# Altium project Function_Generator.PrjPcb
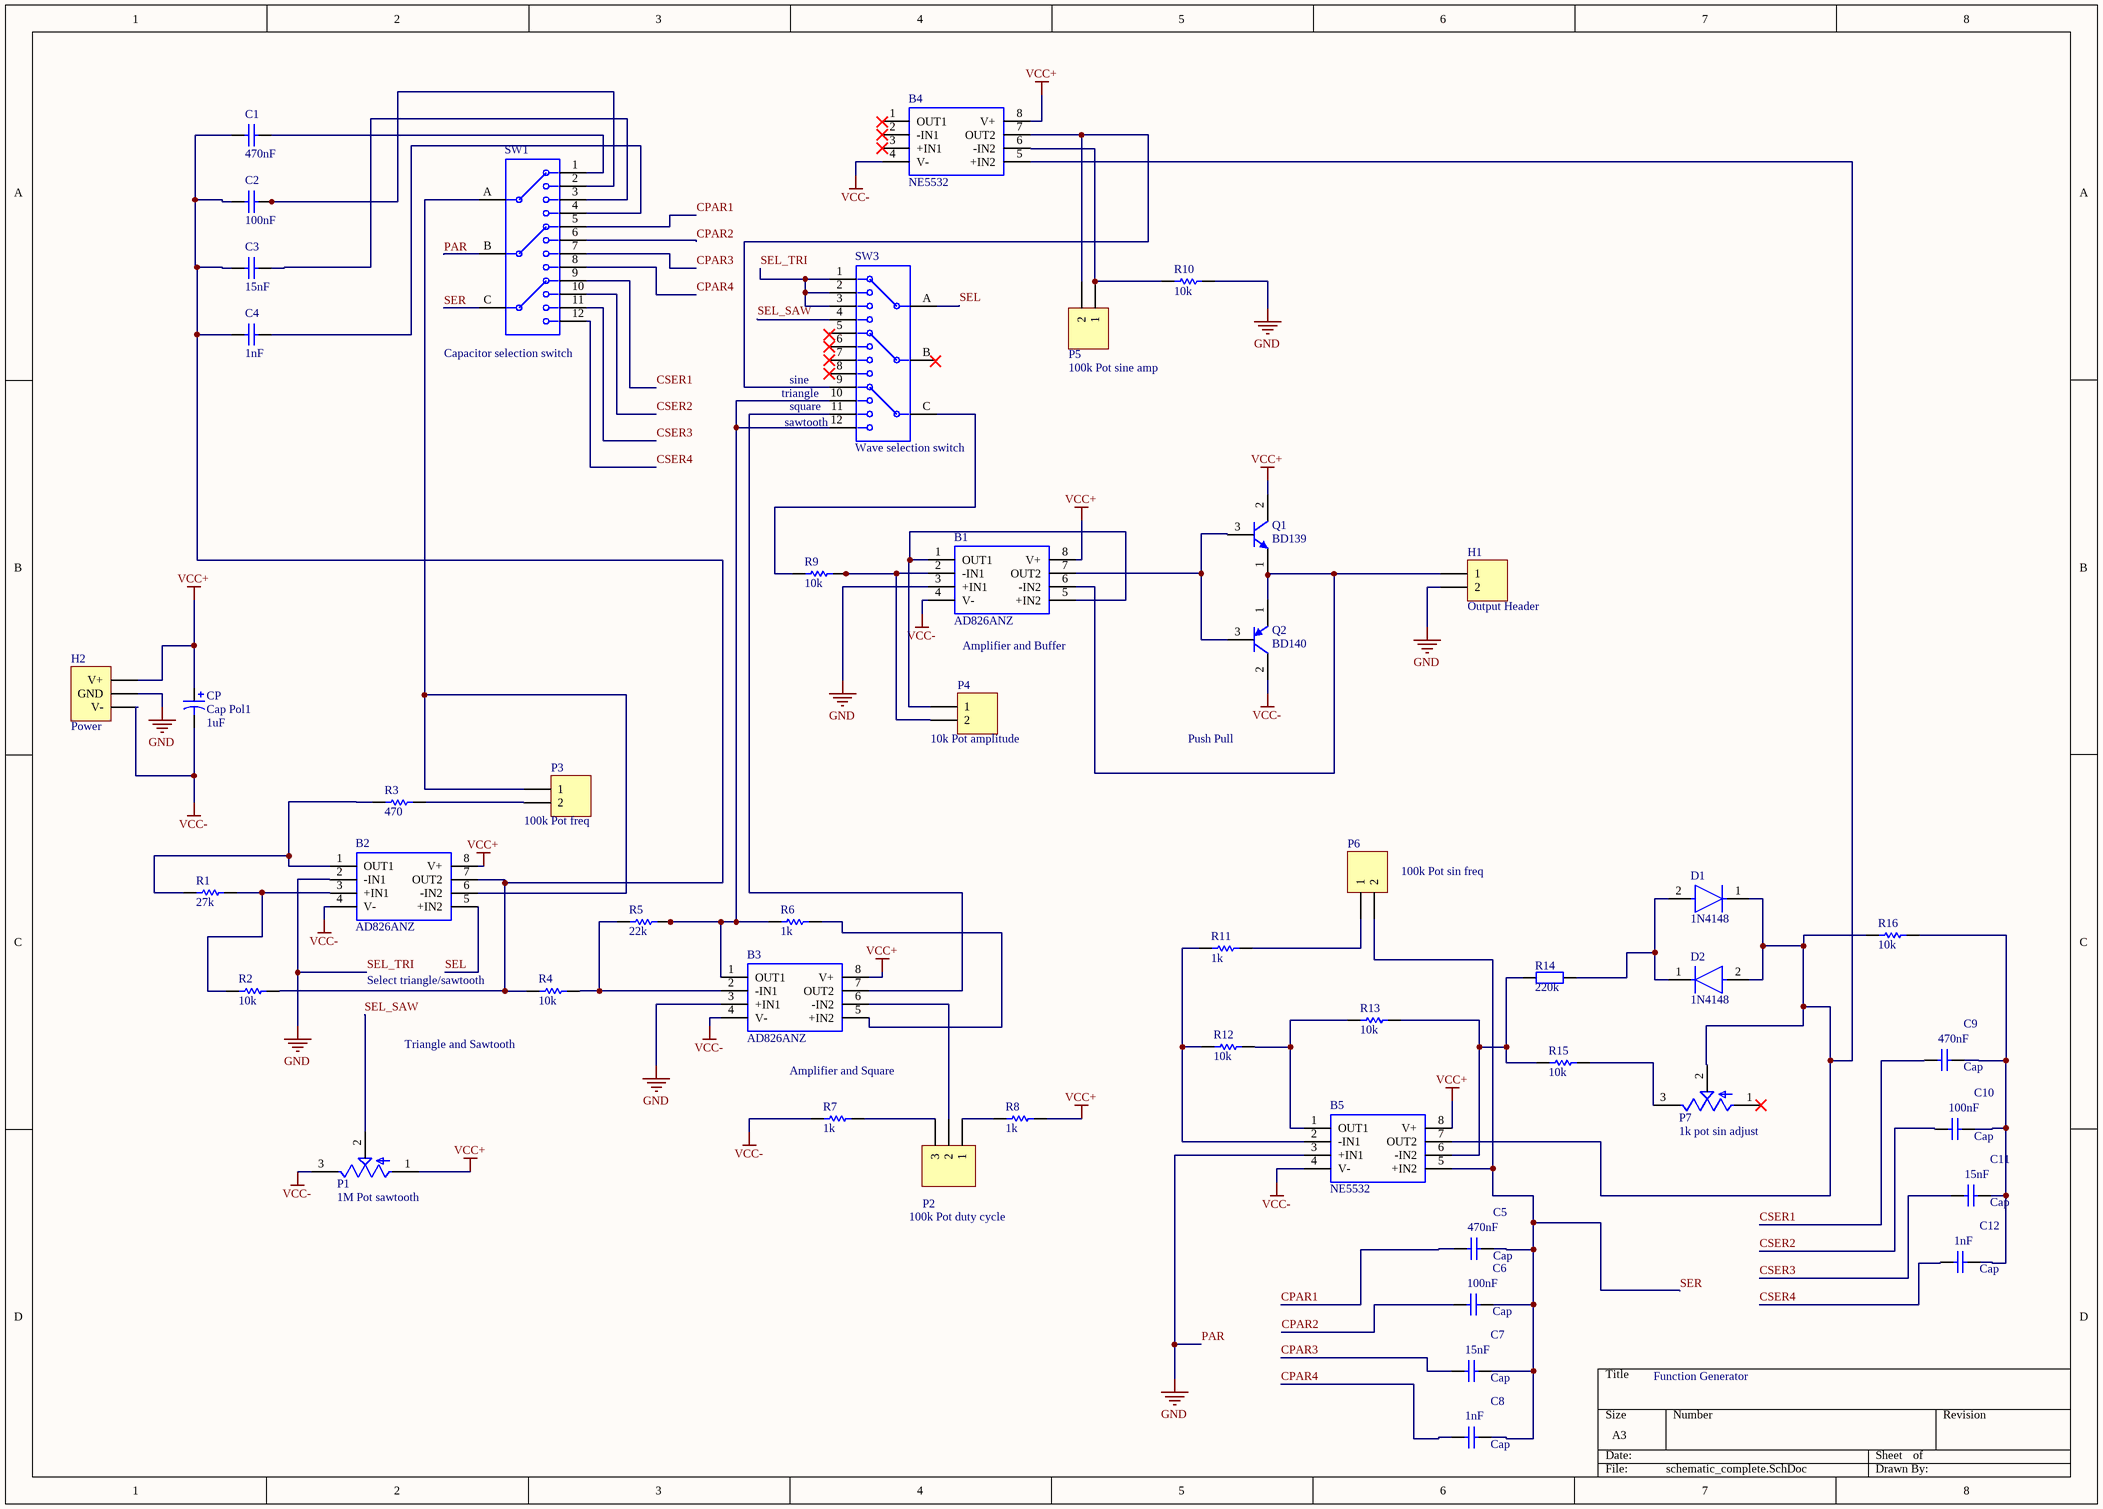
[diagram p0: schematic_complete.SchDoc]
1 sheet, 49 parts. Net scope: global (net labels, ports and power ports of the same name join across sheets).
Board files: pcb_test.PcbDoc, pcb.PcbDoc, pcb_final.PcbDoc

## Sheet schematic_complete.SchDoc
size A3; SheetNumber: 1; SheetTotal: 1; SPICEModelCacheKGHNXYRE: <root> / <DocumentId>KGHNXYRE</DocumentId> / <CacheFrame Number="0"> / <Model Name="cap" Kind="MDL"> / <Text>*Default semiconductor capacitor / .MODEL CAP C()</Text> / </Model> / </CacheFrame> / </root>

### Parts
B1  AD826ANZ  [DIP794W56P254L959H533Q8N]
B2  AD826ANZ  [DIP794W56P254L959H533Q8N]
B3  AD826ANZ  [DIP794W56P254L959H533Q8N]
B4  NE5532  [DIP794W56P254L959H533Q8N]
B5  NE5532  [DIP794W56P254L959H533Q8N]
C1  470nF  [RAD-0.3]
C2  100nF  [RAD-0.3]
C3  15nF  [RAD-0.3]
C4  1nF  [RAD-0.3]
C5  Cap  value 470nF  [RAD-0.3]
C6  Cap  value 100nF  [RAD-0.3]
C7  Cap  value 15nF  [RAD-0.3]
C8  Cap  value 1nF  [RAD-0.3]
C9  Cap  value 470nF  [RAD-0.3]
C10  Cap  value 100nF  [RAD-0.3]
C11  Cap  value 15nF  [RAD-0.3]
C12  Cap  value 1nF  [RAD-0.3]
CP  Cap Pol1  value 1uF  [RB7.6-15]
D1  1N4148  [FP-017AG-MFG]
D2  1N4148  [FP-017AG-MFG]
H1  Output Header  [HDR1X2]
H2  Power  [HDR1X3]
P1  1M Pot sawtooth  [TRIM_3362P-1-253LF]
P2  100k Pot duty cycle  [HDR1X3]
P3  100k Pot freq  [HDR1X2]
P4  10k Pot amplitude  [HDR1X2]
P5  100k Pot sine amp  [HDR1X2]
P6  100k Pot sin freq  [HDR1X2]
P7  1k pot sin adjust  [TRIM_3362P-1-253LF]
Q1  BD139  [ONSC-TO-225-3-77-09]
Q2  BD140  [ONSC-TO-225-3-77-09]
R1  27k  [AXIAL-0.3]
R2  10k  [AXIAL-0.3]
R3  470  [AXIAL-0.3]
R4  10k  [AXIAL-0.3]
R5  22k  [AXIAL-0.3]
R6  1k  [AXIAL-0.3]
R7  1k  [AXIAL-0.3]
R8  1k  [AXIAL-0.3]
R9  10k  [AXIAL-0.3]
R10  10k  [AXIAL-0.3]
R11  1k  [AXIAL-0.3]
R12  10k  [AXIAL-0.3]
R13  10k  [AXIAL-0.3]
R14  220k  [AXIAL-0.4]
R15  10k  [AXIAL-0.3]
R16  10k  [AXIAL-0.3]
SW1  Capacitor selection switch  [SW_A30403RNCQ]
SW3  Wave selection switch  [SW_A30403RNCQ]

### Nets
PAR: B1.3(+IN1) B2.2(-IN1) B3.3(+IN1) B5.3(+IN1) H1.2 H2.2(GND) R10.2 SW1.B SW3.1 SW3.2 SW3.3  [also labelled GND, SEL_TRI]
VCC+: B1.8(V+) B2.8(V+) B3.8(V+) B4.8(V+) B5.8(V+) CP.1 H2.1(V+) P1.1(CCW) Q1.2(C) R8.2
VCC-: B1.4(V-) B2.4(V-) B3.4(V-) B4.4(V-) B5.4(V-) CP.2 H2.3(V-) P1.3(CW) Q2.2(C) R7.1
CPAR1: C5.1 SW1.5
CPAR2: C6.1 SW1.6
CPAR3: C7.1 SW1.7
CPAR4: C8.1 SW1.8
CSER1: C9.1 SW1.9
CSER2: C10.1 SW1.10
CSER3: C11.1 SW1.11
CSER4: C12.1 SW1.12
SEL: B2.5(+IN2) SW3.A
SEL_SAW: P1.2(WIPER) SW3.4
SER: B5.5(+IN2) C5.2 C6.2 C7.2 C8.2 P6.2 SW1.C
NetB1_1: B1.1(OUT1) B1.5(+IN2) P4.1
NetB1_2: B1.2(-IN1) P4.2 R9.2
NetB1_6: B1.6(-IN2) H1.1 Q1.1(E) Q2.1(E)
NetB1_7: B1.7(OUT2) Q1.3(B) Q2.3(B)
NetB2_1: B2.1(OUT1) R1.1 R3.1
NetB2_3: B2.3(+IN1) R1.2 R2.1
NetB2_6: B2.6(-IN2) P3.1 SW1.A
NetB2_7: B2.7(OUT2) C1.1 C2.1 C3.1 C4.1 R2.2 R4.1
NetB3_1: B3.1(OUT1) R5.2 R6.1 SW3.10 SW3.12
NetB3_2: B3.2(-IN1) R4.2 R5.1
NetB3_5: B3.5(+IN2) R6.2
NetB3_6: B3.6(-IN2) P2.2
NetB3_7: B3.7(OUT2) SW3.11
NetB4_5: B4.5(+IN2) B5.7(OUT2) D1.1(C) D2.2(A) P7.2(WIPER) R16.1
NetB4_6: B4.6(-IN2) P5.1 R10.1
NetB4_7: B4.7(OUT2) P5.2 SW3.9
NetB5_1: B5.1(OUT1) R12.2 R13.1
NetB5_2: B5.2(-IN1) R11.1 R12.1
NetB5_6: B5.6(-IN2) R13.2 R14.1 R15.1
NetC1_2: C1.2 SW1.1
NetC2_2: C2.2 SW1.2
NetC3_2: C3.2 SW1.3
NetC4_2: C4.2 SW1.4
NetC9_2: C9.2 C10.2 C11.2 C12.2 R16.2
NetD1_2: D1.2(A) D2.1(C) R14.2
NetP2_1: P2.1 R8.1
NetP2_3: P2.3 R7.2
NetP3_2: P3.2 R3.2
NetP6_1: P6.1 R11.2
NetP7_3: P7.3(CW) R15.2
NetR9_1: R9.1 SW3.C

Not connected (* = marked no-connect by the designer): B4 1(OUT1) 2(-IN1)* 3(+IN1)*; P7 1(CCW)*; SW3 5 6* 7* 8* B

### Notes on the sheet
- (near SW3) sine
- (near SW3) triangle
- (near SW3) sawtooth
- (near SW3) square
- Amplifier and Buffer
- Push Pull
- (near R4) Select triangle/sawtooth
- (near R4) Triangle and Sawtooth
- Amplifier and Square
- Function Generator

### Library data of the parts
B1-B5 = AD826ANZ: AD826ANZ, Dual Operational Amplifier Voltage Feedback 29MHz 9 to 28V, 8-Pin MPDIP; Manufacturer_Name: Analog Devices; Geometry.Height: 5.33mm; Manufacturer_Part_Number: AD826ANZ; Mouser Part Number: 584-AD826ANZ; Mouser Price/Stock: https://www.mouser.co.uk/ProductDetail/Analog-Devices/AD826ANZ/?qs=%2FtpEQrCGXCzLOrhkO%2Fe36g%3D%3D; Arrow Part Number: AD826ANZ; Arrow Price/Stock: https://www.arrow.com/en/products/ad826anz/analog-devices; Mouser Testing Part Number: *; Mouser Testing Price/Stock: *; Datasheet Link: https://datasheet.datasheetarchive.com/originals/distributors/SFDatasheet-4/sf-00084932.pdf
C1-C12 = Cap: Capacitor; Published: 8-Jun-2000; LatestRevisionDate: 17-Jul-2002; LatestRevisionNote: Re-released for DXP Platform.; PackageReference: RAD-0.3; Publisher: Altium Limited; PackageDescription: Radial Cap, Thru-Hole; 2 Leads; 0.3 in Pin Spacing
CP = Cap Pol1: Polarized Capacitor (Radial); Published: 8-Jun-2000; LatestRevisionDate: 17-Jul-2002; LatestRevisionNote: Re-released for DXP Platform.; PackageReference: RB7.6-15; Publisher: Altium Limited; PackageDescription: Polarized Capacitor (Radial); 2 Leads
D1 D2 = CMP-07163-000046-1: DIODE GEN PURP 100V 200MA DO35; Forward Voltage: 1V; Max Power Dissipation: 500mW; Max Reverse Current: 5uA; Forward Current: 300mA; Current: 4A; Reverse Recovery Time: 4ns; Element Configuration: Single; Outside Diameter: 1.85mm; Capacitance: 4pF; Polarity: Standard; Max Forward Surge Current (Ifsm): 1A; Reverse Voltage: 100V; Output Current: 200mA; Average Rectified Current: 200mA; Diameter: 1.91mm; Max Repetitive Reverse Voltage (Vrrm): 100V; Current Rating: 200mA; Case/Package: DO-35; Lead Free: Lead Free; Number of Pins: 2; Recovery Time: 4ns; Packaging: Bulk; Contact Plating: Tin; Voltage: 100V; Mount: Through Hole; Max Surge Current: 4A; Package Quantity: 2000; Width: 1.91mm; Max Reverse Voltage (DC): 100V; Length: 4.56mm; Radiation Hardening: No; Power Dissipation: 500mW; Voltage Rating (DC): 100V; Peak Non-Repetitive Surge Current: 4A; REACH SVHC: No SVHC; Height: 4.56mm; Max Operating Temperature: 175°C; Series: -; Weight: 0.01lb; Min Operating Temperature: -65°C
H1 P3-P6 = Header 2: Header, 2-Pin; LatestRevisionDate: 17-Jul-2002; LatestRevisionNote: Re-released for DXP Platform.; Publisher: Altium Limited
H2 P2 = Header 3: Header, 3-Pin; LatestRevisionDate: 17-Jul-2002; LatestRevisionNote: Re-released for DXP Platform.; Publisher: Altium Limited
P1 P7 = 3362P-1-253LF: 25 kOhms 0.5W, 1/2W PC Pins Through Hole Trimmer Potentiometer Cermet 1 Turn Top Adjustment; MF: Bourns; Check_prices: https://www.snapeda.com/parts/3362P-1-253LF/Bourns/view-part/493663/?ref=eda; SnapEDA_Link: https://www.snapeda.com/parts/3362P-1-253LF/Bourns/view-part/493663/?ref=snap; Availability: Good; Value: *; Purchase-URL: https://pricing.snapeda.com/search/part/3362P-1-253LF/?ref=eda; Price: None; MP: 3362P-1-253LF; Package: 3116 Bourns
Q1 = CMP-1048-01271-1: Plastic Medium-Power Silicon NPN Transistor, 3-Pin TO-225, Bulk Box; Manufacturer: On Semiconductor; IC Continuous (A): 1.5; Packing: Bulk Box; ComponentLink2URL: http://www.onsemi.com/pub_link/Collateral/BD135-D.PDF; ComponentLink2Description: Datasheet; ComponentLink1URL: http://www.onsemi.com/; Polarity: NPN; PartNumber: BD139; ComponentLink1Description: Manufacturer URL; RoHS: FALSE; ComponentLink3Description: Package Specification; PackageReference: TO-225-3-77-09; Mounting Technology: Through Hole; DatasheetVersion: Rev. 16; PackageDescription: 3-Pin Flange Mount, Vertical Straight Lead, Body 7.6 x 2.7 mm, Pitch 2.29 mm; PackageVersion: Rev. AC, 12/2013; ComponentLink3URL: http://www.onsemi.com/pub_link/Collateral/77-09.PDF
Q2 = CMP-1048-00039-1: Plastic Medium-Power Silicon PNP Transistor, 3-Pin TO-225, Bulk Box; Manufacturer: On Semiconductor; IC Continuous (A): 1.5; PartNumber: BD140; ComponentLink1Description: Manufacturer URL; RoHS: FALSE; ComponentLink1URL: http://www.onsemi.com/; DatasheetVersion: Rev. 15; ComponentLink2URL: http://www.onsemi.com/pub_link/Collateral/BD136-D.PDF; ComponentLink3Description: Package Specification; Packing: Bulk Box; PackageVersion: Rev. AC, 12/2013; ComponentLink3URL: http://www.onsemi.com/pub_link/Collateral/77-09.PDF; PackageDescription: 3-Pin Flange Mount, Vertical Straight Lead, Body 7.6 x 2.7 mm, Pitch 2.29 mm; Mounting Technology: Through Hole; PackageReference: TO-225-3-77-09; ComponentLink2Description: Datasheet; Polarity: PNP
R1-R5 R9 R10 R12 R13 R15 R16 = Res1: Resistor; Value: 1K; Published: 8-Jun-2000; LatestRevisionDate: 17-Jul-2002; LatestRevisionNote: Re-released for DXP Platform.; PackageReference: AXIAL-0.3; Publisher: Altium Limited; PackageDescription: Axial Device, Thru-Hole; 2 Leads; 0.3 in Pin Spacing
R6-R8 R11 = Res1: Resistor; Published: 8-Jun-2000; LatestRevisionDate: 17-Jul-2002; LatestRevisionNote: Re-released for DXP Platform.; PackageReference: AXIAL-0.3; Publisher: Altium Limited; PackageDescription: Axial Device, Thru-Hole; 2 Leads; 0.3 in Pin Spacing; Value: 1K
R14 = Res2: Resistor; Value: 1K; Published: 8-Jun-2000; LatestRevisionDate: 17-Jul-2002; LatestRevisionNote: Re-released for DXP Platform.; PackageReference: AXIAL-0.4; Publisher: Altium Limited; PackageDescription: Axial Device, Thru-Hole; 2 Leads; 0.4 in Pin Spacing
SW1 SW3 = A30403RNCQ: Rotary Switch 4 Position 3P4T 2.5A (AC), 350mA (DC) 125VAC Panel Mount, Through Hole; MF: C&K; SnapEDA_Link: https://www.snapeda.com/parts/A30403RNCQ/C&K/view-part/438327/?ref=snap; Availability: Unavailable; Package: None; Price: None; MP: A30403RNCQ; Value: *; Check_prices: https://www.snapeda.com/parts/A30403RNCQ/C&K/view-part/438327/?ref=eda